# EAGLE design Cantaloupe (EAGLE 6.4)

## Sheet 1 of 2
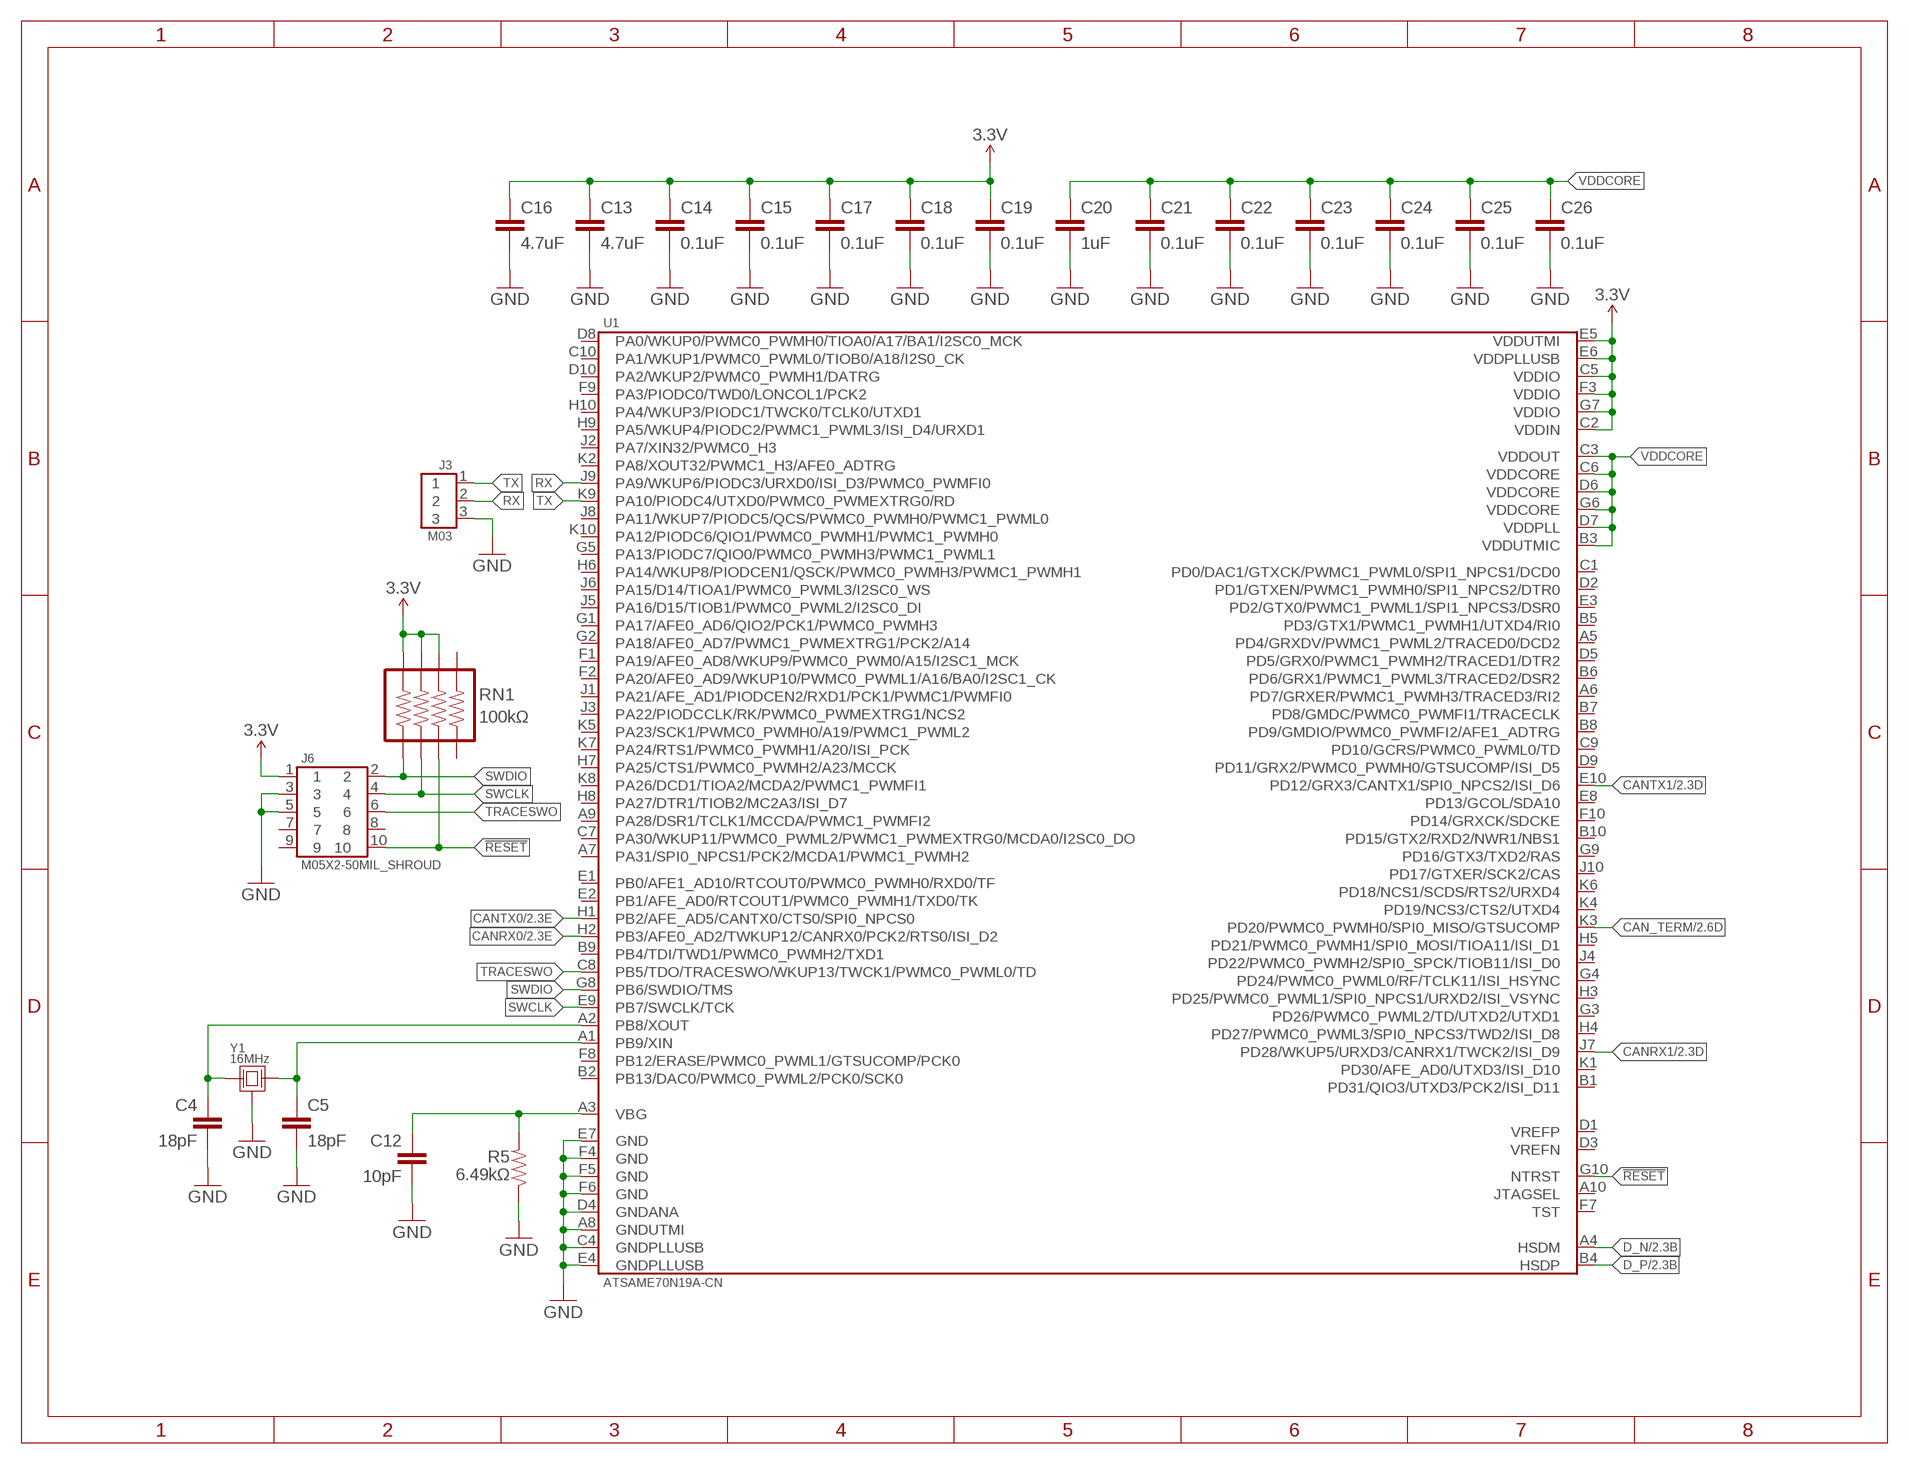
[diagram p0: schematic, sheet 1]

### Parts
C4  18pF  CAP-0603  [0603-CAP]
C5  18pF  CAP-0603  [0603-CAP]
C12  10pF  CAP-0603  [0603-CAP]
C13  4.7uF  CAP-0603  [0603-CAP]
C14  0.1uF  CAP-0603  [0603-CAP]
C15  0.1uF  CAP-0603  [0603-CAP]
C16  4.7uF  CAP-0603  [0603-CAP]
C17  0.1uF  CAP-0603  [0603-CAP]
C18  0.1uF  CAP-0603  [0603-CAP]
C19  0.1uF  CAP-0603  [0603-CAP]
C20  1uF  CAP-0603  [0603-CAP]
C21  0.1uF  CAP-0603  [0603-CAP]
C22  0.1uF  CAP-0603  [0603-CAP]
C23  0.1uF  CAP-0603  [0603-CAP]
C24  0.1uF  CAP-0603  [0603-CAP]
C25  0.1uF  CAP-0603  [0603-CAP]
C26  0.1uF  CAP-0603  [0603-CAP]
J3  M03  [M03]
J6  M05X2-50MIL_SHROUD  [M05X2-50MIL-SHROUD]
R5  6.49kΩ  RESISTOR-0603  [0603-CAP]
RN1  100kΩ  RESISTOR-ARRAY-1206  [1206-RESISTOR_ARRAY]
U1  ATSAME70N19A-CN  [TFBGA-100-9MM]
Y1  16MHz  CRYSTAL-3.2X2.5  [FA-238]

### Nets
3.3V: C13.1 C14.1 C15.1 C16.1 C17.1 C18.1 C19.1 J6.1 RN1.5 RN1.6 RN1.7 U1.C2(VDDIN) U1.C5(VDDIO) U1.E5(VDDUTMI) U1.E6(VDDPLLUSB) U1.F3(VDDIO) U1.G7(VDDIO) ; also sheet 2
!RESET: J6.10 RN1.3 U1.G10(NTRST)
CAN_TERM: U1.K3(PD20/PWMC0_PWMH0/SPI0_MISO/GTSUCOMP) ; also sheet 2
CANRX0: U1.H2(PB3/AFE0_AD2/TWKUP12/CANRX0/PCK2/RTS0/ISI_D2) ; also sheet 2
CANRX1: U1.J7(PD28/WKUP5/URXD3/CANRX1/TWCK2/ISI_D9) ; also sheet 2
CANTX0: U1.H1(PB2/AFE_AD5/CANTX0/CTS0/SPI0_NPCS0) ; also sheet 2
CANTX1: U1.E10(PD12/GRX3/CANTX1/SPI0_NPCS2/ISI_D6) ; also sheet 2
D_N: U1.A4(HSDM) ; also sheet 2
D_P: U1.B4(HSDP) ; also sheet 2
GND: C4.2 C5.2 C12.2 C13.2 C14.2 C15.2 C16.2 C17.2 C18.2 C19.2 C20.2 C21.2 C22.2 C23.2 C24.2 C25.2 C26.2 J3.3 J6.3 J6.5 R5.1 U1.A8(GNDUTMI) U1.C4(GNDPLLUSB) U1.D4(GNDANA) U1.E4(GNDPLLUSB) U1.E7(GND) U1.F4(GND) U1.F5(GND) U1.F6(GND) Y1.2(GND) Y1.4(GND) ; also sheet 2
N$3: C4.1 U1.A2(PB8/XOUT) Y1.1
N$4: C5.1 U1.A1(PB9/XIN) Y1.3
N$22: C12.1 R5.2 U1.A3(VBG)
RX: J3.2 U1.J9(PA9/WKUP6/PIODC3/URXD0/ISI_D3/PWMC0_PWMFI0)
SWCLK: J6.4 RN1.2 U1.E9(PB7/SWCLK/TCK)
SWDIO: J6.2 RN1.1 U1.G8(PB6/SWDIO/TMS)
TRACESWO: J6.6 U1.C8(PB5/TDO/TRACESWO/WKUP13/TWCK1/PWMC0_PWML0/TD)
TX: J3.1 U1.K9(PA10/PIODC4/UTXD0/PWMC0_PWMEXTRG0/RD)
VDDCORE: C20.1 C21.1 C22.1 C23.1 C24.1 C25.1 C26.1 U1.B3(VDDUTMIC) U1.C3(VDDOUT) U1.C6(VDDCORE) U1.D6(VDDCORE) U1.D7(VDDPLL) U1.G6(VDDCORE)
Unconnected: J6.7 J6.8 J6.9 RN1.4 RN1.8 U1.A5(PD4/GRXDV/PWMC1_PWML2/TRACED0/DCD2) U1.A6(PD7/GRXER/PWMC1_PWMH3/TRACED3/RI2) U1.A7(PA31/SPI0_NPCS1/PCK2/MCDA1/PWMC1_PWMH2) U1.A9(PA28/DSR1/TCLK1/MCCDA/PWMC1_PWMFI2) U1.A10(JTAGSEL) U1.B1(PD31/QIO3/UTXD3/PCK2/ISI_D11) U1.B2(PB13/DAC0/PWMC0_PWML2/PCK0/SCK0) U1.B5(PD3/GTX1/PWMC1_PWMH1/UTXD4/RI0) U1.B6(PD6/GRX1/PWMC1_PWML3/TRACED2/DSR2) U1.B7(PD8/GMDC/PWMC0_PWMFI1/TRACECLK) U1.B8(PD9/GMDIO/PWMC0_PWMFI2/AFE1_ADTRG) U1.B9(PB4/TDI/TWD1/PWMC0_PWMH2/TXD1) U1.B10(PD15/GTX2/RXD2/NWR1/NBS1) U1.C1(PD0/DAC1/GTXCK/PWMC1_PWML0/SPI1_NPCS1/DCD0) U1.C7(PA30/WKUP11/PWMC0_PWML2/PWMC1_PWMEXTRG0/MCDA0/I2SC0_DO) U1.C9(PD10/GCRS/PWMC0_PWML0/TD) U1.C10(PA1/WKUP1/PWMC0_PWML0/TIOB0/A18/I2S0_CK) U1.D1(VREFP) U1.D2(PD1/GTXEN/PWMC1_PWMH0/SPI1_NPCS2/DTR0) U1.D3(VREFN) U1.D5(PD5/GRX0/PWMC1_PWMH2/TRACED1/DTR2) U1.D8(PA0/WKUP0/PWMC0_PWMH0/TIOA0/A17/BA1/I2SC0_MCK) U1.D9(PD11/GRX2/PWMC0_PWMH0/GTSUCOMP/ISI_D5) U1.D10(PA2/WKUP2/PWMC0_PWMH1/DATRG) U1.E1(PB0/AFE1_AD10/RTCOUT0/PWMC0_PWMH0/RXD0/TF) U1.E2(PB1/AFE_AD0/RTCOUT1/PWMC0_PWMH1/TXD0/TK) U1.E3(PD2/GTX0/PWMC1_PWML1/SPI1_NPCS3/DSR0) U1.E8(PD13/GCOL/SDA10) U1.F1(PA19/AFE0_AD8/WKUP9/PWMC0_PWM0/A15/I2SC1_MCK) U1.F2(PA20/AFE0_AD9/WKUP10/PWMC0_PWML1/A16/BA0/I2SC1_CK) U1.F7(TST) U1.F8(PB12/ERASE/PWMC0_PWML1/GTSUCOMP/PCK0) U1.F9(PA3/PIODC0/TWD0/LONCOL1/PCK2) U1.F10(PD14/GRXCK/SDCKE) U1.G1(PA17/AFE0_AD6/QIO2/PCK1/PWMC0_PWMH3) U1.G2(PA18/AFE0_AD7/PWMC1_PWMEXTRG1/PCK2/A14) U1.G3(PD26/PWMC0_PWML2/TD/UTXD2/UTXD1) U1.G4(PD24/PWMC0_PWML0/RF/TCLK11/ISI_HSYNC) U1.G5(PA13/PIODC7/QIO0/PWMC0_PWMH3/PWMC1_PWML1) U1.G9(PD16/GTX3/TXD2/RAS) U1.H3(PD25/PWMC0_PWML1/SPI0_NPCS1/URXD2/ISI_VSYNC) U1.H4(PD27/PWMC0_PWML3/SPI0_NPCS3/TWD2/ISI_D8) U1.H5(PD21/PWMC0_PWMH1/SPI0_MOSI/TIOA11/ISI_D1) U1.H6(PA14/WKUP8/PIODCEN1/QSCK/PWMC0_PWMH3/PWMC1_PWMH1) U1.H7(PA25/CTS1/PWMC0_PWMH2/A23/MCCK) U1.H8(PA27/DTR1/TIOB2/MC2A3/ISI_D7) U1.H9(PA5/WKUP4/PIODC2/PWMC1_PWML3/ISI_D4/URXD1) U1.H10(PA4/WKUP3/PIODC1/TWCK0/TCLK0/UTXD1) U1.J1(PA21/AFE_AD1/PIODCEN2/RXD1/PCK1/PWMC1/PWMFI0) U1.J2(PA7/XIN32/PWMC0_H3) U1.J3(PA22/PIODCCLK/RK/PWMC0_PWMEXTRG1/NCS2) U1.J4(PD22/PWMC0_PWMH2/SPI0_SPCK/TIOB11/ISI_D0) U1.J5(PA16/D15/TIOB1/PWMC0_PWML2/I2SC0_DI) U1.J6(PA15/D14/TIOA1/PWMC0_PWML3/I2SC0_WS) U1.J8(PA11/WKUP7/PIODC5/QCS/PWMC0_PWMH0/PWMC1_PWML0) U1.J10(PD17/GTXER/SCK2/CAS) U1.K1(PD30/AFE_AD0/UTXD3/ISI_D10) U1.K2(PA8/XOUT32/PWMC1_H3/AFE0_ADTRG) U1.K4(PD19/NCS3/CTS2/UTXD4) U1.K5(PA23/SCK1/PWMC0_PWMH0/A19/PWMC1_PWML2) U1.K6(PD18/NCS1/SCDS/RTS2/URXD4) U1.K7(PA24/RTS1/PWMC0_PWMH1/A20/ISI_PCK) U1.K8(PA26/DCD1/TIOA2/MCDA2/PWMC1_PWMFI1) U1.K10(PA12/PIODC6/QIO1/PWMC0_PWMH1/PWMC1_PWMH0)

## Sheet 2 of 2
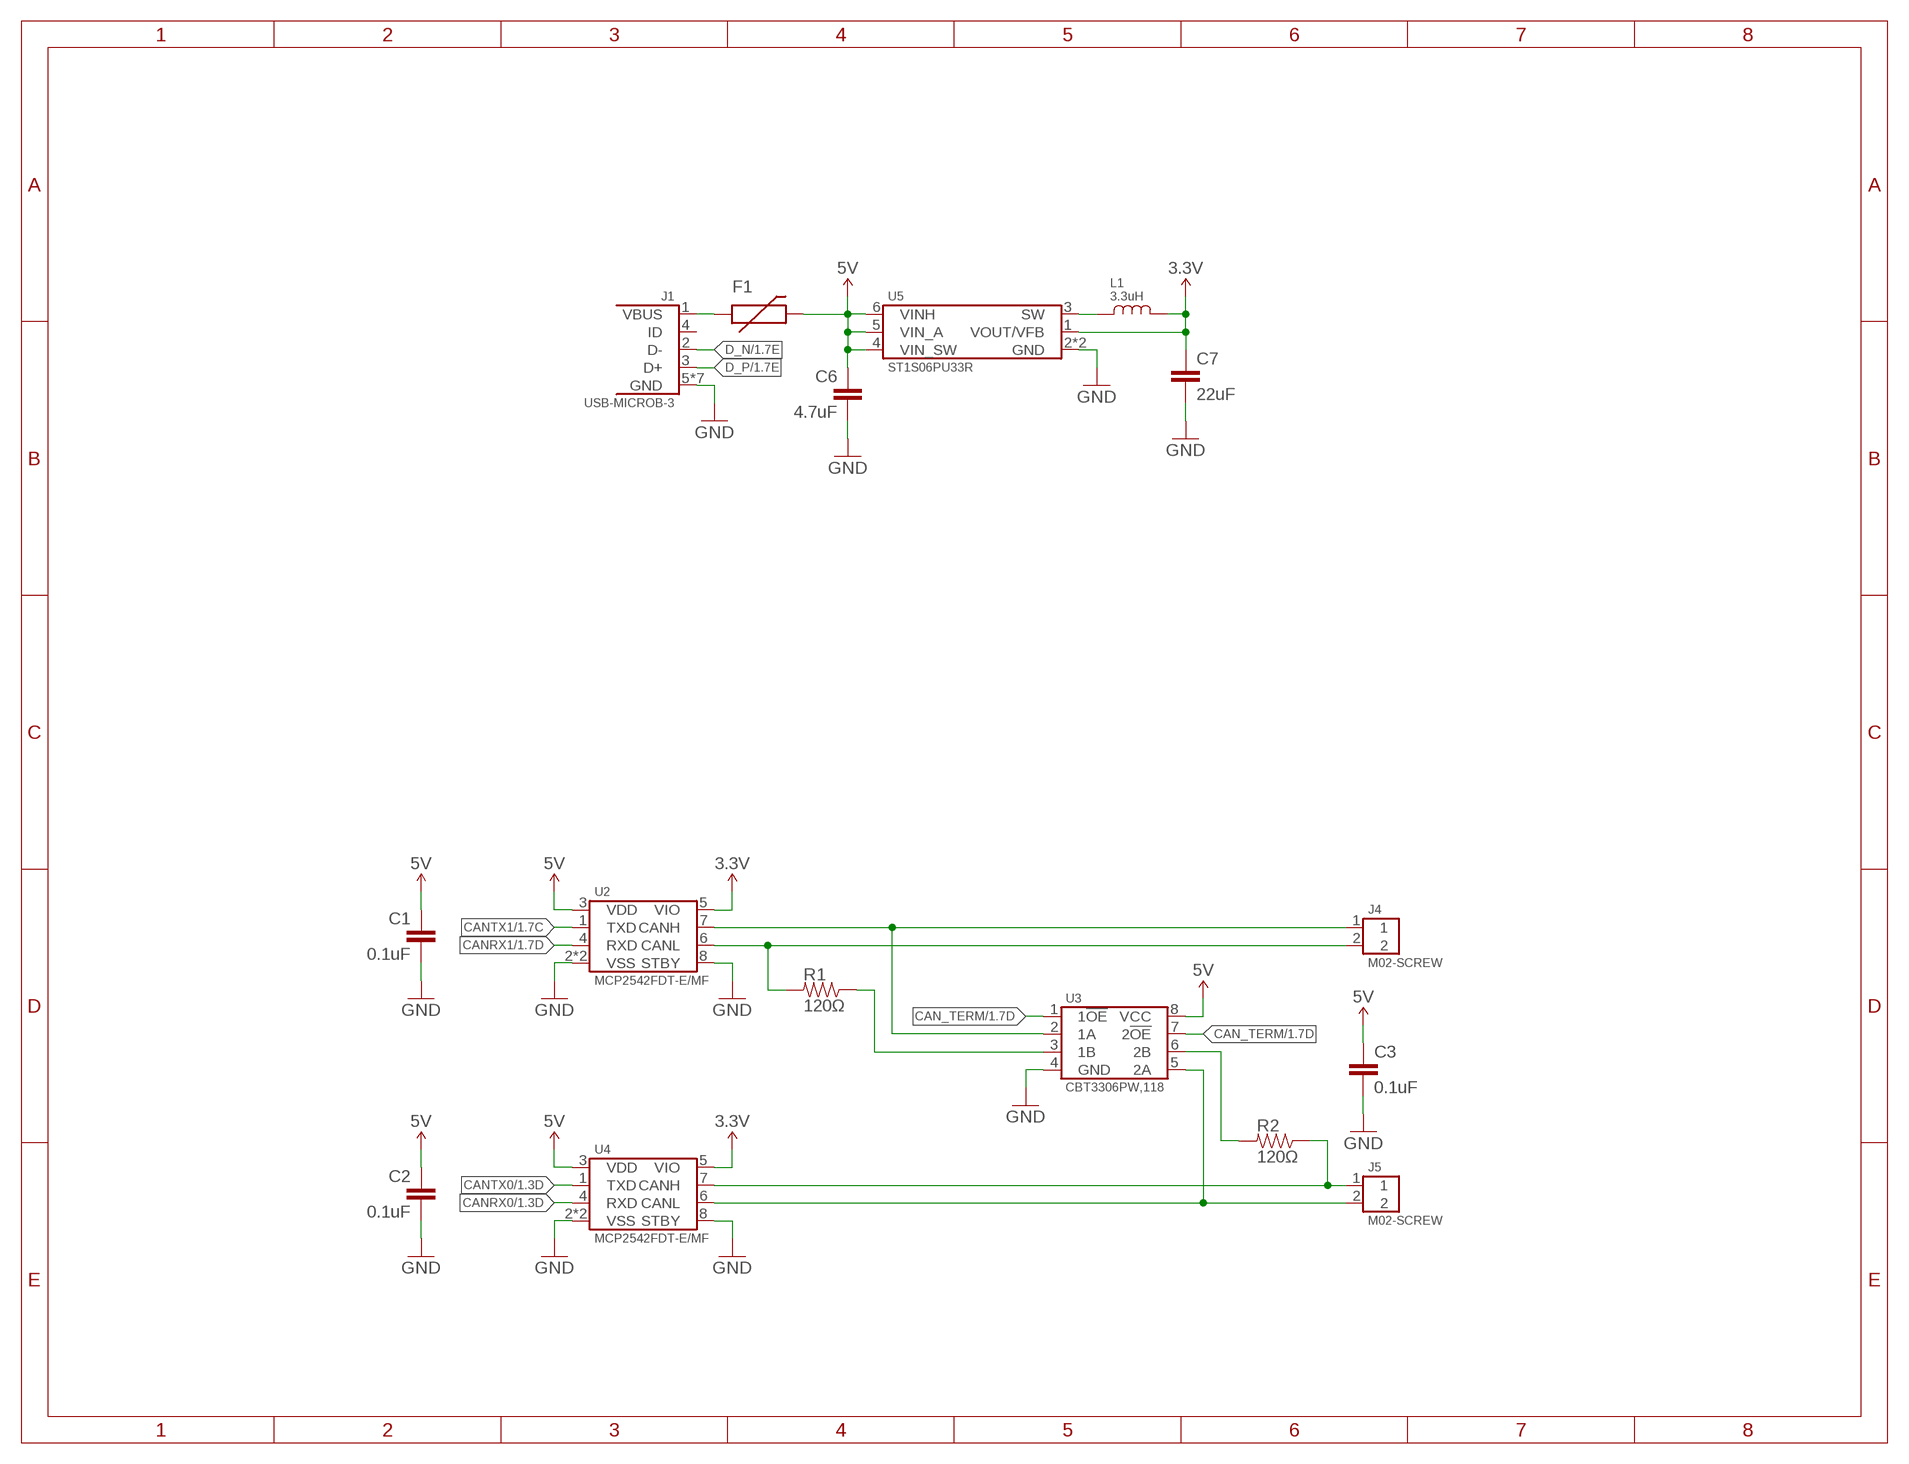
[diagram p1: schematic, sheet 2]

### Parts
C1  0.1uF  CAP-0603  [0603-CAP]
C2  0.1uF  CAP-0603  [0603-CAP]
C3  0.1uF  CAP-0603  [0603-CAP]
C6  4.7uF  CAP-0603  [0603-CAP]
C7  22uF  CAP-1206  [1206]
F1  PTC-1206  [1206-PTC]
J1  USB-MICROB-3  [10118192-0001LF]
J4  M02-SCREW  [M02-SCREW]
J5  M02-SCREW  [M02-SCREW]
L1  3.3uH  INDUCTOR-1008  [1008-INDUCTOR]
R1  120Ω  RESISTOR-0603  [0603-CAP]
R2  120Ω  RESISTOR-0603  [0603-CAP]
U2  MCP2542FDT-E/MF  [DFN-8-3X3]
U3  CBT3306PW,118  [TSSOP8-4.4MM]
U4  MCP2542FDT-E/MF  [DFN-8-3X3]
U5  ST1S06PU33R  ST1S06XX  [DFN-6-3MM]

### Nets
3.3V: C7.1 L1.P$2 U2.5(VIO) U4.5(VIO) U5.1(VOUT/VFB) ; also sheet 1
5V: C1.1 C2.1 C3.1 C6.1 F1.P$2 U2.3(VDD) U3.8(VCC) U4.3(VDD) U5.4(VIN_SW) U5.5(VIN_A) U5.6(VINH)
CAN_TERM: U3.1(1!OE) U3.7(2!OE) ; also sheet 1
CANRX0: U4.4(RXD) ; also sheet 1
CANRX1: U2.4(RXD) ; also sheet 1
CANTX0: U4.1(TXD) ; also sheet 1
CANTX1: U2.1(TXD) ; also sheet 1
D_N: J1.2(D-) ; also sheet 1
D_P: J1.3(D+) ; also sheet 1
GND: C1.2 C2.2 C3.2 C6.2 C7.2 J1.5(GND) J1.P$6(GND) J1.P$7(GND) J1.P$8(GND) J1.P$9(GND) J1.P$10(GND) J1.P$11(GND) U2.2(VSS) U2.8(STBY) U2.PAD(VSS) U3.4(GND) U4.2(VSS) U4.8(STBY) U4.PAD(VSS) U5.2(GND) U5.PAD(GND) ; also sheet 1
N$1: R1.1 U3.3(1B)
N$2: R2.2 U3.6(2B)
N$5: J4.1 U2.7(CANH) U3.2(1A)
N$6: J4.2 R1.2 U2.6(CANL)
N$7: J5.1 R2.1 U4.7(CANH)
N$8: J5.2 U3.5(2A) U4.6(CANL)
N$9: F1.P$1 J1.1(VBUS)
N$11: L1.P$1 U5.3(SW)
Unconnected: J1.4(ID)

## Library data of the parts
C1-C7 C12-C26 = Passives:CAP
F1 = Passives:PTC
J1 = Connectors:USB-MICROB
J3 = Connectors:M03
J4 J5 = Connectors:M02
J6 = Connectors:M05X2
L1 = Passives:INDUCTOR
R1 R2 R5 = Passives:RESISTOR
RN1 = Passives:RESISTOR-ARRAY
U1 = Atmel:ATSAME70N19
U2 U4 = Microchip:MCP2542
U3 = NXP:CBT3306
U5 = STMicroelectrionics:ST1S06XX
Y1 = Passives:CRYSTAL

## Board
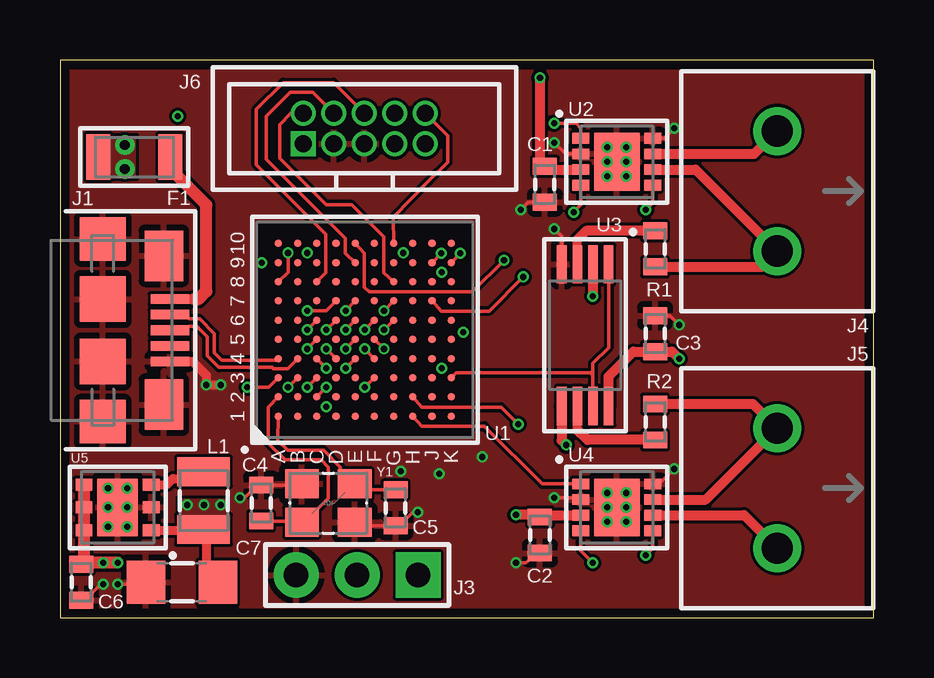
[diagram p2: board, top side]
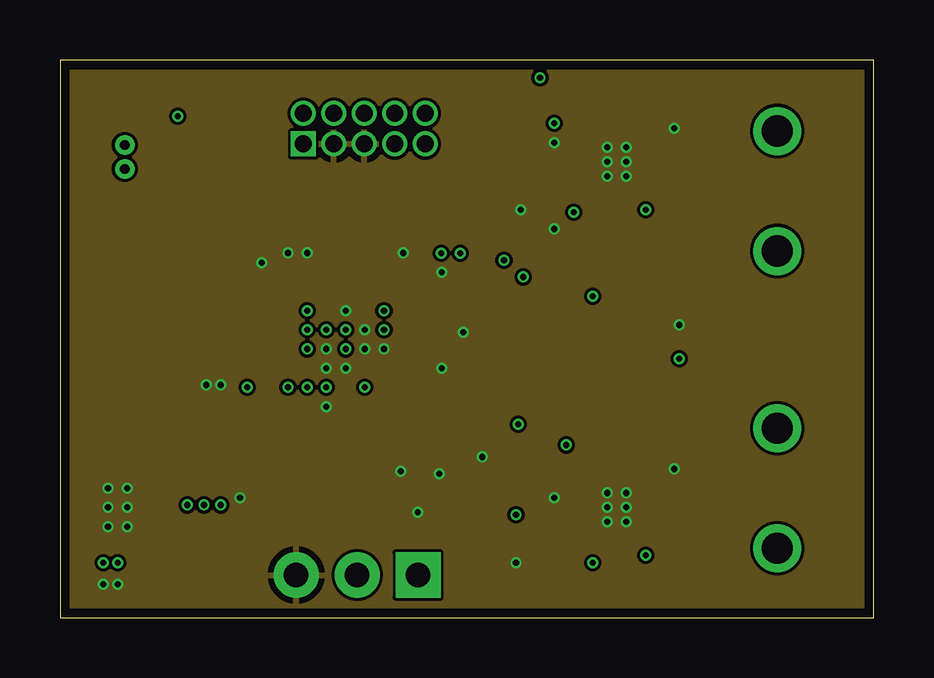
[diagram p3: board, inner layer Route2]
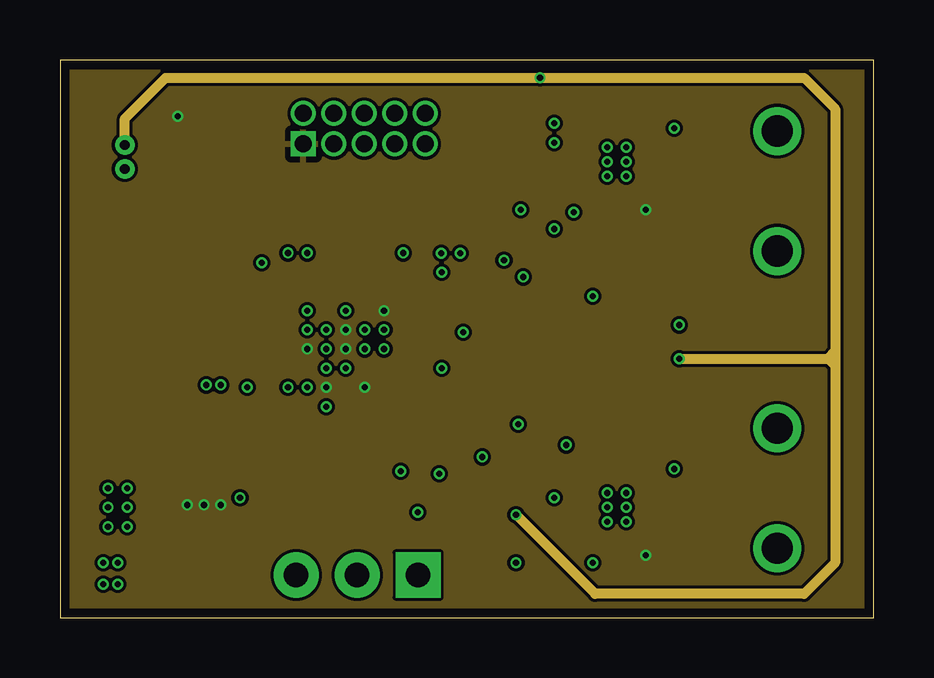
[diagram p4: board, inner layer Route15]
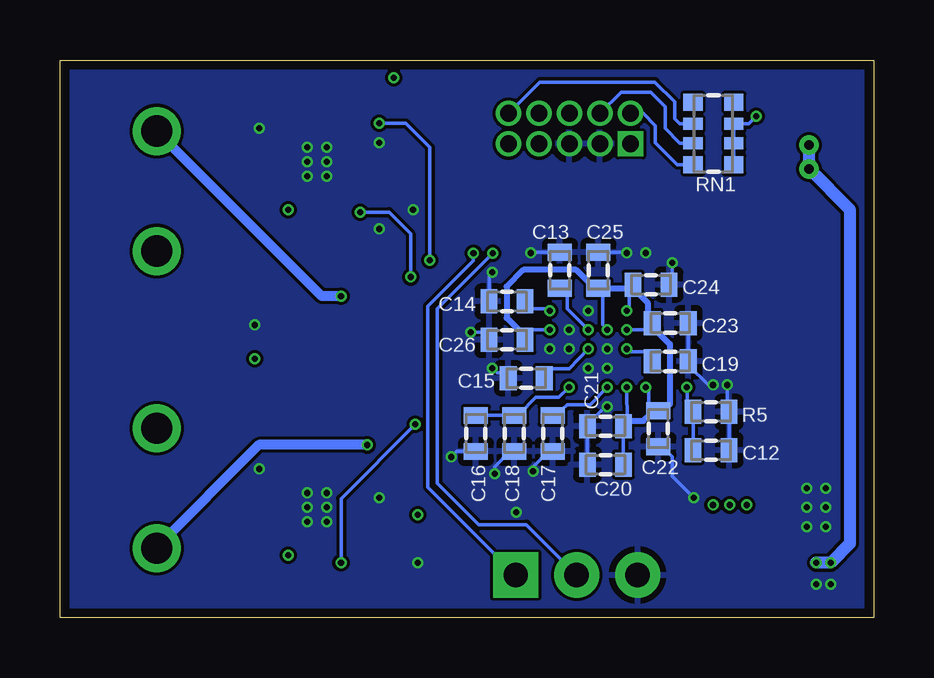
[diagram p5: board, bottom side, seen from below]

Size 33.91 x 23.24 mm. Coordinates in mm from the lower left corner, seen from the top.
Outline: 0,0 33.91,0 33.91,23.24 0,23.24 0,0
Copper layers (1*2*15*16): Top 0.035559375mm / dielectric 0.17018125mm / Route2 0.01778125mm / dielectric 47mil / Route15 0.01778125mm / dielectric 0.17018125mm / Bottom 0.035559375mm
Design rules "OSHPark-4layer *": minimum track width 5mil, minimum drill 10mil, track to track 5mil, track to pad 5mil, pad to pad 5mil, via to via 5mil, smd to smd 5mil, copper to edge 15mil, drill to drill 6mil, minimum pad ring 4mil, minimum via ring 4mil, stop-mask expansion 4mil, vias tented up to drill 20mil, thermal gap 10mil

### Footprints (pad centres in the part's own frame; a part is rotated, then mirrored left to right if it is on the bottom)
0603-CAP = smd 0.7 x 1: 1 -0.75,0; 2 0.75,0
1206 = smd 1.6 x 1.8: 1 -1.5,0; 2 1.5,0
1206-PTC = smd 1 x 1.9: P$1 1.5,0; P$2 -1.5,0
10118192-0001LF = smd 1.6 x 0.4: 1 -0.1,1.3; 2 -0.1,0.65; 3 -0.1,0; 4 -0.1,-0.65; 5 -0.1,-1.3 | smd 1.6 x 2.1: P$6 -0.35,-3.1; P$7 -0.35,3.1 | smd 1.9 x 1.9: P$8 -2.9,1.3; P$9 -2.9,-1.3 | smd 1.9 x 1.8: P$10 -2.9,3.8; P$11 -2.9,-3.8
M03 = drill 1.016 pad 1.88 square: 1 -2.54,0 | drill 1.016 pad 1.88: 2 0,0; 3 2.54,0
M02-SCREW = drill 1.3 pad 2: 1 -2.5,0; 2 2.5,0
M05X2-50MIL-SHROUD = drill 0.7 pad 1 square: 1 -2.54,-0.635 | drill 0.7 pad 1: 2 -2.54,0.635; 3 -1.27,-0.635; 4 -1.27,0.635; 5 0,-0.635; 6 0,0.635; 7 1.27,-0.635; 8 1.27,0.635; 9 2.54,-0.635; 10 2.54,0.635
1008-INDUCTOR = smd 1.2 x 2.2: P$1 -1.2,0; P$2 1.2,0
1206-RESISTOR_ARRAY = smd 0.8 x 0.7: 1 -0.85,-1.3; 4 -0.85,1.3; 5 0.85,-1.3; 8 0.85,1.3 | smd 0.8 x 0.5: 2 -0.85,-0.4; 3 -0.85,0.4; 6 0.85,-0.4; 7 0.85,0.4
TFBGA-100-9MM = smd 0.32 x 0.32: A1 -3.6,3.6; A2 -2.8,3.6; A3 -2,3.6; A4 -1.2,3.6; A5 -0.4,3.6; A6 0.4,3.6; A7 1.2,3.6; A8 2,3.6; A9 2.8,3.6; A10 3.6,3.6; B1 -3.6,2.8; B2 -2.8,2.8; B3 -2,2.8; B4 -1.2,2.8; B5 -0.4,2.8; B6 0.4,2.8; B7 1.2,2.8; B8 2,2.8; B9 2.8,2.8; B10 3.6,2.8; C1 -3.6,2; C2 -2.8,2; C3 -2,2; C4 -1.2,2; C5 -0.4,2; C6 0.4,2; C7 1.2,2; C8 2,2; C9 2.8,2; C10 3.6,2; D1 -3.6,1.2; D2 -2.8,1.2; D3 -2,1.2; D4 -1.2,1.2; D5 -0.4,1.2; D6 0.4,1.2; D7 1.2,1.2; D8 2,1.2; D9 2.8,1.2; D10 3.6,1.2; E1 -3.6,0.4; E2 -2.8,0.4; E3 -2,0.4; E4 -1.2,0.4; E5 -0.4,0.4; E6 0.4,0.4; E7 1.2,0.4; E8 2,0.4; E9 2.8,0.4; E10 3.6,0.4; F1 -3.6,-0.4; F2 -2.8,-0.4; F3 -2,-0.4; F4 -1.2,-0.4; F5 -0.4,-0.4; F6 0.4,-0.4; F7 1.2,-0.4; F8 2,-0.4; F9 2.8,-0.4; F10 3.6,-0.4; G1 -3.6,-1.2; G2 -2.8,-1.2; G3 -2,-1.2; G4 -1.2,-1.2; G5 -0.4,-1.2; G6 0.4,-1.2; G7 1.2,-1.2; G8 2,-1.2; G9 2.8,-1.2; G10 3.6,-1.2; H1 -3.6,-2; H2 -2.8,-2; H3 -2,-2; H4 -1.2,-2; H5 -0.4,-2; H6 0.4,-2; H7 1.2,-2; H8 2,-2; H9 2.8,-2; H10 3.6,-2; J1 -3.6,-2.8; J2 -2.8,-2.8; J3 -2,-2.8; J4 -1.2,-2.8; J5 -0.4,-2.8; J6 0.4,-2.8; J7 1.2,-2.8; J8 2,-2.8; J9 2.8,-2.8; J10 3.6,-2.8; K1 -3.6,-3.6; K2 -2.8,-3.6; K3 -2,-3.6; K4 -1.2,-3.6; K5 -0.4,-3.6; K6 0.4,-3.6; K7 1.2,-3.6; K8 2,-3.6; K9 2.8,-3.6; K10 3.6,-3.6
DFN-8-3X3 = smd 0.7 x 0.45: 1 -1.5,0.975; 2 -1.5,0.325; 3 -1.5,-0.325; 4 -1.5,-0.975; 5 1.5,-0.975; 6 1.5,-0.325; 7 1.5,0.325; 8 1.5,0.975 | smd 1.9 x 2.4: PAD 0,0
TSSOP8-4.4MM = smd 1.6 x 0.4: 1 -2.95,0.975; 2 -2.95,0.325; 3 -2.95,-0.325; 4 -2.95,-0.975; 5 2.95,-0.975; 6 2.95,-0.325; 7 2.95,0.325; 8 2.95,0.975
DFN-6-3MM = smd 0.7 x 0.5: 1 -1.4,0.95; 2 -1.4,0; 3 -1.4,-0.95; 4 1.4,-0.95; 5 1.4,0; 6 1.4,0.95 | smd 1.695 x 2.4: PAD 0,0
FA-238 = smd 1.4 x 1.2: 1 -1.1,-0.8; 2 1.1,-0.8; 3 1.1,0.8; 4 -1.1,0.8

### Placement (x,y rotation side)
C1  20.2,18.06 270 top
C2  20,3.45 270 top
C3  24.8,11.84 90 top
C4  8.38,4.78 90 top
C5  13.98,4.58 270 top
C6  0.88,1.48 270 top
C7  5.08,1.48 180 top
C12  6.78,6.98 0 bottom
C13  13.08,14.48 90 bottom
C14  15.28,13.18 180 bottom
C15  14.48,9.98 180 bottom
C16  16.58,7.68 270 bottom
C17  13.38,7.68 270 bottom
C18  14.98,7.68 270 bottom
C19  8.48,10.68 0 bottom
C20  11.18,6.38 180 bottom
C21  11.18,7.98 180 bottom
C22  8.98,7.88 270 bottom
C23  8.48,12.28 0 bottom
C24  9.28,13.88 0 bottom
C25  11.48,14.48 90 bottom
C26  15.28,11.58 180 bottom
F1  3.1,19.2 0 top
J1  4.68,11.98 0 top
J3  12.38,1.78 180 top
J4  29.88,17.78 270 top
J5  29.88,5.4 270 top
J6  12.68,20.38 0 top
L1  5.98,4.88 270 top
R1  24.8,15.37 270 top
R2  24.8,8.16 270 top
R5  6.78,8.58 180 bottom
RN1  6.68,20.18 0 bottom
U1  12.7,12 90 top
U2  23.2,19 0 top
U3  21.88,11.78 270 top
U4  23.2,4.6 0 top
U5  2.4,4.6 180 top
Y1  11.18,4.78 0 top

### Tracks (layer width: path | path; a pad name or v marks a point on that pad's centre or on a via)
3.3V  (via drill 0.25)
  Top 0.152: U1.C5 v10.3,11.2 | U1.E5 v11.9,11.2 | U1.F3 v12.7,9.6 | U1.E6 v11.9,12 | U1.G7 v13.5,12.8 | U1.C2 v11.1,9.6 | U4.5 24.7,2.9 v24.4,2.6 | U2.5 24.7,17.3 v24.4,17
  Top 0.381: U5.1 5.95,3.65 L1.P$2 6.1,3.56 6.1,2.2 6.58,1.72 C7.1
  Bottom 0.152: C19.1 9.23,11.08 10.18,11.08 v10.3,11.2 | v13.5,12.8 13.58,12.88 14.53,12.88 C14.1 | 14.78,8.48 14.08,9.18 13.12,9.18 v12.7,9.6 | 14.78,8.48 14.83,8.43 | C17.1 13.13,8.68 12.98,8.68 12.78,8.88 11.82,8.88 v11.1,9.6 | v11.9,11.2 12.68,10.38 13.73,10.38 C15.1 | v11.9,12 12.78,12.88 12.78,13.73 C13.1 | 14.78,8.48 14.98,8.48 C18.1 C16.1 | RN1.5 RN1.6 RN1.7 5.22,20.58 v4.9,20.9
  other vias: 5.3,4.7 6,4.7 6.7,4.7
  pour Route15: -1.14,24.38 35.05,24.38 35.05,-1.14 -1.14,-1.14
  pour Top (no thermals): 5,3.2 6.9,3.2 6.9,4.9 5,4.9
5V  (via drill 0.25, 0.41 pad 0.81)
  Top 0.406: U3.8 22.86,10.06 23.89,11.09 C3.1 25.51,11.09 v25.8,10.8 | U4.3 20.18,4.28 C2.1 19.9,4.3 v19,4.3 | U2.3 20.34,18.68 C1.1 20,19.01 v20,22.5
  Top 0.508: v2.4,2.3 v1.8,2.3 0.95,2.3 C6.1 1,2.35 U5.6 U5.5 U5.4
  Route15 0.406: v2.7,19.7 2.7,20.8 4.4,22.5 v20,22.5 31,22.5 32.3,21.2 32.3,11.1 | 32.3,11.1 32.3,10.8 | 32.3,10.8 32.3,10.5 | 32.3,10.5 32.3,2.3 31,1 22.3,1 v19,4.3 | v25.8,10.8 32,10.8 | 32,10.8 32.3,10.8 | 32.3,11.1 32,10.8 | 32,10.8 32.3,10.5
  Bottom 0.508: v2.7,19.7 v2.7,18.7 1,17 1,3.1 v1.8,2.3 v2.4,2.3
  pour Top (no thermals): 1.2,20 3.1,20 3.1,18.4 1.2,18.4
!RESET
  Top 0.152: U1.G10 13.89,16.7 15.37,18.2 16.15,18.98 16.15,20.09 J6.10
  Bottom 0.152: RN1.3 8.08,20.58 8.3,20.8 8.3,21.5 9.12,22.32 13.92,22.32 J6.10
CAN_TERM
  Top 0.152: U3.1 22.86,11.26 22.21,10.61 22.21,10.2 | 22.21,10.2 U3.7 | U1.K3 16.5,10.2 22.1,10.2 | 22.1,10.2 22.21,10.2 | 22.2,10.1 22.1,10.2 | 22.1,10.2 22.2,10.3
CANRX0  (via drill 0.25)
  Top 0.152: U1.H2 15.08,8.78 18.38,8.78 v19.1,8.06 | v22.2,2.3 21.7,2.8 U4.4
  Bottom 0.152: v19.1,8.06 22.2,4.96 v22.2,2.3
CANRX1  (via drill 0.25)
  Top 0.152: U1.J7 15.88,12.78 17.88,12.78 v19.3,14.2 | U2.4 21.7,17.2 v21.4,16.9
  Bottom 0.152: v21.4,16.9 20.2,16.9 19.3,16 v19.3,14.2
CANTX0
  Top 0.152: U1.H1 15.08,7.98 17.68,7.98 20.09,5.58 U4.1
CANTX1  (via drill 0.25)
  Top 0.152: U1.E10 12.68,15.18 12.68,13.78 12.88,13.58 17.18,13.58 v18.5,14.9 | U2.1 21.7,20.4 21.5,20.6 v20.6,20.6
  Bottom 0.152: v20.6,20.6 19.5,20.6 18.5,19.6 v18.5,14.9
D_N
  Top 0.152: U1.A4 9.03,10.73 6.74,10.73 6.43,11.04 6.43,11.84 5.82,12.46 5.38,12.46 5.28,12.56 4.66,12.56 J1.2
D_P
  Top 0.152: U1.B4 9.48,10.38 8.88,10.38 8.83,10.43 6.62,10.43 6.13,10.92 6.13,11.72 5.69,12.15 5.38,12.15 5.28,12.06 4.66,12.06 J1.3
GND  (via drill 0.25)
  Top 0.152: C3.2 25.41,12.59 v25.8,12.2 | U1.C4 v11.1,10.4 | U1.D4 v11.1,11.2 | U1.E4 v11.9,10.4 | U1.F5 v13.5,11.2 | U1.F6 v12.7,12 | U1.E7 v11.9,12.8 | v7.5,5 7.7,5 8.23,5.53 C4.2 10.03,5.53 Y1.4 | v14.9,4.4 14.7,4.4 14.13,3.83 C5.2 12.43,3.83 Y1.2 | U4.2 21.69,5 v20.6,5 | U2.8 25.18,19.98 v25.6,20.4 | U4.8 24.98,5.58 v25.6,6.2 | U2.2 21.07,19.32 v20.6,19.8 | C1.2 19.51,17.31 v19.2,17 | U3.4 20.91,15.89 v20.6,16.2 | v19,2.3 19.4,2.3 19.8,2.6 C2.2 | C6.2 1.03,0.73 1.7,1.4 v1.8,1.4 | v2.4,1.4 3.5,1.4 C7.2 | U1.F4 v12.7,11.2 | U1.A8 9.5,14.4 v9.5,15.2
  Top 0.381: J1.5 5.52,10.68 6.1,10.1 v6.1,9.7 v6.7,9.7
  Bottom 0.152: C25.2 10.33,15.23 v10.3,15.2 | C13.2 14.27,15.23 v14.3,15.2 | C14.2 16.03,14.27 v15.9,14.4 | C26.2 16.03,11.9 v16.8,11.9 | C15.2 15.4,9.98 15.4,10.2 15.7,10.2 v15.9,10.4 | C16.2 17.37,6.93 v17.6,6.7 | C18.2 15.17,6.93 15.8,6.3 v15.8,6 | C17.2 13.57,6.93 14.2,6.3 v14.2,6.1 | C20.2 C21.2 11.93,8.07 11.2,8.8 v11.1,8.8 | C12.2 R5.1 6.1,8.65 v6.1,9.7 | C24.2 8.4,14.01 v8.4,14.8 | C22.2 8.83,7.13 8.4,6.7 8.4,5.9 v7.5,5 | C23.2 C19.2 7.73,10.53 6.9,9.7 v6.7,9.7
  other vias: 2.8,5.4 2,5.4 2.8,4.6 2,4.6 2.8,3.8 2,3.8 23.6,5.2 23.6,4.6 23.6,4 22.8,4 22.8,4.6 22.8,5.2 23.6,19 23.6,19.6 23.6,18.4 22.8,18.4 22.8,19 22.8,19.6
  pour Route2: -0.76,24 34.67,24 34.67,-0.76 -0.76,-0.76
  pour Bottom: -1.52,24.77 35.43,24.77 35.43,-1.52 -1.52,-1.52
  pour Top (rank 2): -0.38,-0.38 34.29,-0.38 34.29,23.62 -0.38,23.62
N$1
  Top 0.381: U3.3 21.56,15.76
  Top 0.406: R1.1 21.92,16.12 21.56,15.76
N$2
  Top 0.381: 21.56,7.84 U3.6
  Top 0.406: R2.2 21.99,7.41 21.56,7.84
N$3
  Top 0.152: C4.1 10.08,4.03 Y1.1 10.58,4.48 10.68,4.48 11.18,4.98 11.18,6.28 10.88,6.58 9.38,6.58 8.68,7.28 8.68,8.78 U1.A2
N$4
  Top 0.152: C5.1 12.28,5.33 Y1.3 11.68,5.58 11.68,6.28 10.98,6.98 9.48,6.98 9.08,7.38 U1.A1
N$5  (via drill 0.25)
  Top 0.406: U2.7 28.93,19.32 J4.1 | U3.2 v22.21,13.41 v22.2,13.4
  Bottom 0.406: v22.2,13.4 23,13.4 J4.1
N$6
  Top 0.406: R1.2 29.22,14.62 J4.2 26.49,18.68 U2.6
N$7
  Top 0.406: R2.1 28.87,8.91 J5.1 26.91,4.92 U4.7
N$8  (via drill 0.25)
  Top 0.406: U4.6 28.51,4.28 J5.2 | U3.5 20.91,7.39 v21.1,7.2
  Bottom 0.406: v21.1,7.2 25.62,7.2 29.9,2.92 J5.2
N$9
  Top 0.381: J1.1 5.58,13.28
  Top 0.508: 5.58,13.28 5.78,13.28 6.1,13.6 6.1,17.2 4.8,18.5 4.8,18.96 F1.P$1
N$10
  cutout Top: 8.3,16.4 17.1,16.4 17.1,7.6 8.3,7.6
N$11
  Top 0.381: U5.3 4.45,5.55 4.7,5.8 5.7,5.8 L1.P$1
N$22  (via drill 0.25)
  Top 0.152: U1.A3 8.7,9.6 v7.8,9.6
  Bottom 0.152: C12.1 R5.2 7.53,8.98 7.78,8.98 7.78,9.58 v7.8,9.6
RX  (via drill 0.25)
  Top 0.152: U1.J9 v15.88,15.18
  Bottom 0.152: v15.88,15.18 18.18,12.88 18.18,5.61 16.45,3.88 14.48,3.88 J3.2
SWCLK
  Top 0.152: U1.E9 11.88,15.18 11.88,15.82 8.6,19.1 8.6,20.9 9.6,21.9 10.53,21.9 J6.4
  Bottom 0.152: RN1.2 8.08,19.78 8.7,20.4 8.7,21.3 9.3,21.9 10.53,21.9 J6.4
SWDIO
  Top 0.152: U1.G8 13.48,14.38 13.48,15.88 12.16,17.2 11.1,17.2 9.15,19.15 9.15,20.55 9.62,21.02 J6.2
  Bottom 0.152: RN1.1 8.18,18.88 9.1,19.8 9.1,20.5 9.62,21.02 J6.2
TRACESWO
  Top 0.152: U1.C8 11.08,14.38 11.08,15.98 8.18,18.88 8.18,21.18 9.3,22.3 11.4,22.3 J6.6
TX  (via drill 0.25)
  Top 0.152: U1.K9 v16.68,15.18
  Bottom 0.152: v16.68,15.18 16.68,14.88 18.58,12.98 18.58,5.44 J3.1
VDDCORE  (via drill 0.25)
  Top 0.152: v10.3,12.8 11.1,12.8 U1.D7 | U1.C6 v10.3,12 | U1.D6 v11.1,12 | U1.G6 v13.5,12 | U1.B3 v9.5,9.6 | U1.C3 v10.3,9.6
  Bottom 0.152: C20.1 C21.1 10.28,8.13 v10.3,9.6 | C22.1 9.38,8.63 9.38,9.48 v9.5,9.6 | C24.1 10.2,13.71 10.2,13.7 10.2,12.9 v10.3,12.8 | v10.3,12 9.51,12 C23.1 | v11.1,12 11.3,12.2 11.3,13.5 11.48,13.68 C25.1 | v13.5,12 14.53,12 C26.1
  Bottom 0.254: 10.2,13.7 11.45,13.7 C25.1 11.48,13.9 11.8,13.9 12.4,14.5 14.6,14.5 15.3,13.8 15.3,12.5 14.7,11.9 14.53,11.9 C26.1 | C24.1 9.9,13.75 9.9,13.6 9.4,13.1 9.4,12.45 C23.1 9,12.05 9,11.9 8.5,11.4 8.5,8.9 8.6,8.8 8.81,8.8 C22.1 9.11,8.5 9.3,8.5 9.6,8.2 10.3,8.2 10.28,8.18 10.28,8.13